# Altium schematic sheet PowerManager.SchDoc
size A4; SheetNumber: 3; SheetTotal: 7
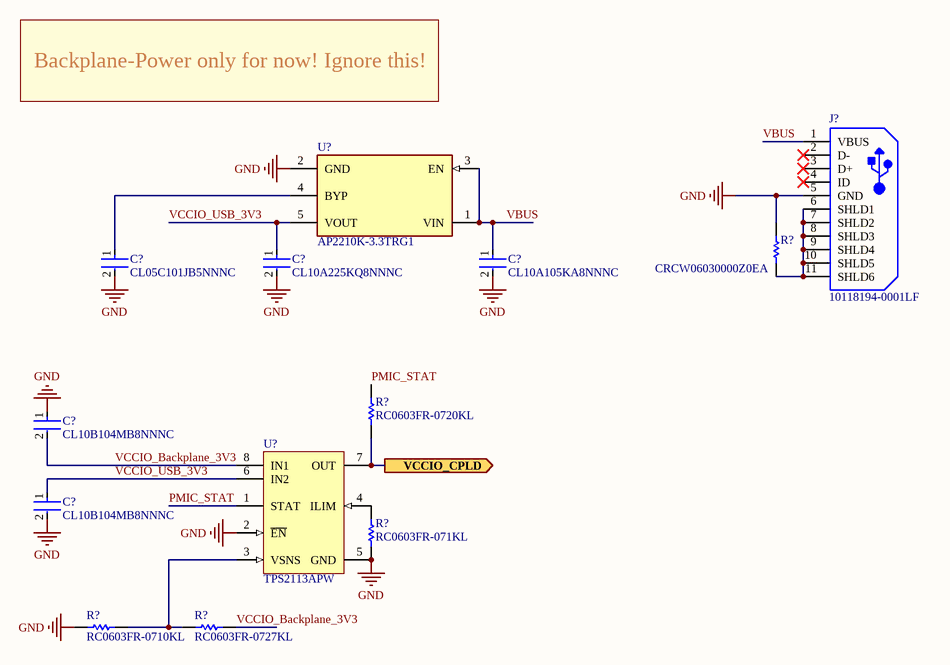
[diagram p0: PowerManager.SchDoc]

## Parts
(Parts that share a designator on the sheet are numbered #1, #2 ... from top to bottom, then left to right.)
C?#1  CL05C101JB5NNNC  [FP-CL05-MFG]
C?#2  CL10A225KQ8NNNC  [FP-CL10-IPC_C]
C?#3  CL10A105KA8NNNC  [FP-CL10-IPC_C]
C?#4  CL10B104MB8NNNC  [FP-CL10-IPC_C]
C?#5  CL10B104MB8NNNC  [FP-CL10-IPC_C]
J?  10118194-0001LF  [FCI-10118194-0001LF-5_V]
R?#1  CRCW06030000Z0EA  [RESC1609X50X30NL8T20]
R?#2  RC0603FR-0720KL  [RESC1608X55X25LL10T15]
R?#3  RC0603FR-071KL  [RESC1608X55X25NL10T15]
R?#4  RC0603FR-0710KL  [RESC1608X55X25ML10T15]
R?#5  RC0603FR-0727KL  [RESC1608X55X25LL10T15]
U?#1  AP2210K-3.3TRG1  [FP-SOT25-MFG]
U?#2  TPS2113APW  [PW0008A_N]

## Ports
VCCIO_CPLD (out)

## Nets
GND: C?#1.2 C?#2.2 C?#3.2 C?#4.1 C?#5.2 J?.5(GND) R?#1.2 R?#3.1 R?#4.1 U?#1.2(GND) U?#2.2(~{EN}) U?#2.5(GND)
PMIC_STAT: R?#2.2 U?#2.1(STAT)
VBUS: C?#3.1 J?.1(VBUS) U?#1.1(VIN) U?#1.3(EN)
VCCIO_Backplane_3V3: C?#4.2 R?#5.2 U?#2.8(IN1)
VCCIO_CPLD: R?#2.1 U?#2.7(OUT) ; port VCCIO_CPLD
VCCIO_USB_3V3: C?#2.1 C?#5.1 U?#1.5(VOUT) U?#2.6(IN2)
NetC?#1_1: C?#1.1 U?#1.4(BYP)
NetJ?_6: J?.6(SHLD1) J?.7(SHLD2) J?.8(SHLD3) J?.9(SHLD4) J?.10(SHLD5) J?.11(SHLD6) R?#1.1
NetR?#3_2: R?#3.2 U?#2.4(ILIM)
NetR?#4_2: R?#4.2 R?#5.1 U?#2.3(VSNS)

Not connected (* = marked no-connect by the designer): J? 2(D-)* 3(D+)* 4(ID)*

## Notes on the sheet
- Backplane-Power only for now! Ignore this!

## Library data of the parts
C?#1 = CMP-13271-000010-1: CAP CER 100PF 50V C0G/NP0 0402; Manufacturer: Samsung; Tolerance: 5%; Temperature Characteristic: C0G; Material: Ceramic; Temperature Coefficient: 30ppm/°C; Capacitance: 100pF; Package: CL05; Device Class L1: Passive Components; Automotive: No; Ipc Land Pattern Name: CAPC10050X50; ComponentLink2URL: http://www.samsungsem.com/global/front/downloadcms.do?path=%2F%2Fglobal%2F%2Fsupport%2F%2Fproduct-search%2F%2Fmlcc%2F%2F__icsFiles%2F%2Fafieldfile%2F%2F2019%2F%2F06%2F%2F18&fileName=CL05C101JB5NNNC-19.pdf; Temperature: -55°C to +125°C; Device Class L2: Capacitors; Digikey Description: CAP CER 100PF 50V C0G/NP0 0402; Value: 100pF; Octopart: https://octopart.com/cl05c101jb5nnnc-samsung-9299367; Manufacturer Part Number: CL05C101JB5NNNC; Temperature Range High: +125°C; Temperature Range Low: -55°C; Lead Free: Yes; ComponentLink2Description: Datasheet; RoHS: TRUE; Device Class L3: Ceramic Capacitors; Height: 0.55mm; Voltage Rating: 50V; Category: Cap
C?#2 = CMP-13271-002410-1: Cap Ceramic 2.2uF 6.3V X5R ±10% Pad SMD 0603 +85°C T/R; Case Code (Imperial): 0603; Voltage: 6.3V; Dielectric: X5R; Capacitance: 2.2uF; Mount: Surface Mount; Packaging: Tape and Reel; Depth: 0.8mm; Voltage Rating (DC): 6.3V; Length: 1.6mm; Case Code (Metric): 1608; Min Operating Temperature: -55°C; Width: 0.031inch; Lead Free: Lead Free; Contact Plating: Tin; Voltage Rating: 6.3V; Thickness: 0.035inch; Tolerance: 10%; Case/Package: 0603; Radiation Hardening: No; Package Quantity: 1; Height: 0.8mm; Max Operating Temperature: 85°C
C?#3 = CMP-13271-004127-1: Cap Ceramic 1uF 25V X5R ±10% Pad SMD 0603 +85°C T/R; Height: 0.8mm; Capacitance: 1uF; Depth: 0.8mm; Package Quantity: 1; Mount: Surface Mount; Contact Plating: Tin; Voltage Rating: 25V; Dielectric: X5R; Packaging: Tape and Reel; Material: Ceramic; Case Code (Metric): 1608; Length: 1.6mm; Voltage: 25V; Min Operating Temperature: -55°C; Width: 0.031inch; Tolerance: 10%; Case/Package: 0603; Radiation Hardening: No; Case Code (Imperial): 0603; Thickness: 0.035inch; Lead Free: Lead Free; Max Operating Temperature: 85°C; Voltage Rating (DC): 25V
C?#4 C?#5 = CMP-13271-001724-1: Cap Ceramic 100nF 50V X7R ±20% Pad SMD 0603 +125°C T/R; Mount: Surface Mount; Lead Free: Lead Free; Max Operating Temperature: 125°C; Voltage Rating: 50V; Case Code (Imperial): 0603; Capacitance: 100nF; Height: 0.8mm; Length: 1.6mm; Tolerance: 20%; Case Code (Metric): 1608; Thickness: 0.035inch; Depth: 0.8mm; Width: 0.031inch; Package Quantity: 1; Min Operating Temperature: -55°C; Case/Package: 0603; Radiation Hardening: No; Voltage Rating (DC): 50V; Dielectric: X7R; Packaging: Tape and Reel
J? = CMP-2000-05120-1: Micro USB B Type Receptacle, 1.8 A, -55 to 85 degC, 5-Pin SMD, RoHS, Tape and Reel; Manufacturer: Amphenol FCI; Body Orientation: RightAngle; Number of Contacts: 5; Pitch: 0.65mm; Gender: RCP; Rad Hard: No; Package Reference: 10118194-0001LF-5; Mounting: SurfaceMount; Manufacturer URL: http://www.fci.com/; Packaging: CutTape; Datasheet URL: https://datasheet.ciiva.com/26945/getdatasheetpartid-418619-26945695.pdf; Termination Method: Solder; Package Description: 5-Pin Surface Mount Device, Body 8.05 x 5.53 mm, Pitch 0.65 mm; Type: MicroUSBTypeB; Datasheet Version: Rev. A, 10/2011
R?#1 = CMP-2000-03816-5: Chip Resistor, 0 Ohm, Jumper, 100 mW, -55 to 155 degC, 0603 (1608 Metric), RoHS, Tape and Reel; Manufacturer: Vishay Semiconductor; Voltage Rating: 75 V; Package Quantity: 5000; DatasheetVersion: 06/2012; Min Operating Temperature: -55 degC; ComponentLink1URL: http://www.vishay.com/; Mounting Technology: Surface Mount; Height: 0.45 mm; ComponentLink1Description: Manufacturer URL; REACH SVHC: Unknown; PackageReference: 0603; Packaging: Tape and Reel; Max Operating Temperature: 155 degC; Mount: Surface Mount; ComponentLink2Description: Datasheet; PackageDescription: 2-Pin Surface Mount Device, Body 1.575 x 0.85 mm; Length: 1.55 mm; ComponentLink2URL: http://www.vishay.com/docs/20035/dcrcwe3.pdf; Pins: 2; RoHSCompliant: true
R?#2 = CMP-2000-06932-1: Chip Resistor, 20 KOhm, +/- 1%, 0.1 W, -55 to 155 degC, 0603 (1608 Metric), RoHS, Tape and Reel; Manufacturer: Yageo; Power Rating: 100mW; Temperature Coefficient: 100PPM/C; Resistance: 20kOhms; Voltage Rating: 50V; Case Code - in: 0603; Packaging: Reel; Datasheet Version: Rev. 7, 05/2017; Series: RC; Mounting Technology: SurfaceMount; Product: ThickFilmResistorsGeneralPurpose; Manufacturer URL: http://www.yageo.com/; Package Description: 2-Pin Surface Mount Device, Body 1.6 x 0.8 mm; Package Reference: 0603; Termination Style: SMD/SMT; Case Code - mm: 1608; Operating Temperature Range: -55Cto+155C; Datasheet URL: http://www.yageo.com/documents/recent/PYu-RC_Group_51_RoHS_L_7.pdf; Tolerance: 1%
R?#3 = CMP-1659-00009-4: Chip Resistor, 1 KOhm, +/-1%, 0.1 W, -55 to 155 degC, 0603 (1608 Metric), RoHS, Tape and Reel; Manufacturer: Yageo; Voltage Rating: 50 V; ComponentLink2URL: http://www.yageo.com/documents/recent/PYu-RC_Group_51_RoHS_L_04.pdf; Max Operating Temperature: 155 degC; PackageDescription: 2-Pin Surface Mount Device, Body 1.6 x 0.8 mm; Packaging: Tape and Reel; ComponentLink3Description: Package Specification; REACH SVHC: No SVHC; Mount: Surface Mount; ComponentLink2Description: Datasheet; Length: 1.6 mm; PackageReference: 0603; Height: 0.45 mm; DatasheetVersion: Rev. 4, 02/2016; Min Operating Temperature: -55 degC; ComponentLink1Description: Manufacturer URL; Package Quantity: 200; RoHSCompliant: true; ComponentLink3URL: http://www.farnell.com/datasheets/443971.pdf; Pins: 2; Mounting Technology: Surface Mount; ComponentLink1URL: http://www.yageo.com/
R?#4 = CMP-2100-03664-1: Chip Resistor, 10 KOhm, +/- 1%, 01 W, -55 to 155 degC, 0603 (1608 Metric), RoHS, Tape and Reel; Manufacturer: Yageo; Temperature Coefficient: 100ppm/degreesC; Resistance: 10KOhm; Voltage Rating: 75V; Power Rating: 100mW; Voltage Rating (DC): 50V; Composition: ThickFilm; RoHSCompliant: true; Height: 0.45mm; Lead Free: LeadFree; Case Code (Metric): 1608; Case/Package: 0603; Datasheet Version: Rev. 5, 10/2016; Package Reference: 0603; Depth: 0.8mm; Package Description: 2-Pin Surface Mount Device, Body 1.6 x 0.8 mm; Case Code (Imperial): 0603; Packaging: TapeandReel; Termination: SMD/SMT; Lead Pitch: 0.3mm; Width: 0.8mm; Number of Pins: 2; Length: 1.6mm; REACH SVHC: NoSVHC; Military Standard: Not; Max Operating Temperature: 155degC; Min Operating Temperature: -55degC; Manufacturer URL: http://www.yageo.com/; Datasheet URL: http://www.yageo.com/NewPortal/yageodocoutput?fileName=/pdf/R-Chip/PYu-RC_Group_51_RoHS_L_5.pdf; Weight: 7.1E-05oz; Tolerance: 1%
R?#5 = CMP-2000-06933-1: Chip Resistor, 27 KOhm, +/- 1%, 0.1 W, -55 to 155 degC, 0603 (1608 Metric), RoHS, Tape and Reel; Manufacturer: Yageo; Resistance: 27kOhms; Temperature Coefficient: 100PPM/C; Power Rating: 100mW; Voltage Rating: 50V; Mounting Technology: SurfaceMount; Operating Temperature Range: -55Cto+155C; Case Code - in: 0603; Product: ThickFilmResistorsGeneralPurpose; Package Reference: 0603; Datasheet Version: Rev. 7, 05/2017; Tolerance: 1%; Manufacturer URL: http://www.yageo.com/; Termination Style: SMD/SMT; Packaging: Reel; Series: RC; Package Description: 2-Pin Surface Mount Device, Body 1.6 x 0.8 mm; Datasheet URL: http://www.yageo.com/documents/recent/PYu-RC_Group_51_RoHS_L_7.pdf; Case Code - mm: 1608
U?#1 = CMP-12756-000023-1: IC REG LINEAR 3.3V 300MA SOT23-5; Manufacturer: Diodes; Number Of Outputs: 1; Max Supply Voltage: 13.2V; Max Junction Temp: +125°C; Accuracy Percentage: 1%; Nominal Supply Current: 0.01uA; Output Type: Fixed; Min Supply Voltage: 2.5V; Dropout Voltage: 250mV; Standoff Height: 0.013mm; Temperature: -40°C to +85°C; Temperature Range High: +85°C; Device Class L3: Voltage Regulators - Linear; Package: SOT25; ComponentLink2Description: Datasheet; ComponentLink2URL: https://www.diodes.com/assets/Datasheets/AP2210.pdf; Digikey Description: IC REG LINEAR 3.3V 300MA SOT23-5; Height: 1.4mm; Lead Free: Yes; Footprint Url: https://www.diodes.com/assets/Package-Files/SOT25.pdf; Mouser Description: LDO Voltage Regulators 300mA CMOS LDO 3.3V 250mV; Output Current: 300mA; Output Voltage: 3.3V; Category: IC; Octopart: https://octopart.com/ap2210k-3.3trg1-diodes+inc.-30954630; RoHS: TRUE; Device Class L1: Integrated Circuits (ICs); Temperature Range Low: -40°C; Device Class L2: Power Management ICs; Automotive: No; Manufacturer Part Number: AP2210K-3.3TRG1
U?#2 = CMP-0339-00043-2: Dual In / Single Out Autoswitching Power Mux, 2.8 to 5.5 V, -40 to 85 degC, 8-pin TSSOP (PW), Green (RoHS & no Sb/Br); Manufacturer: Texas Instruments; IN2 Output Current(Max)(A): 1.25; SubFamily: Power Multiplexer (MUX); IN2 rDS(on)(Typ)(Ohms): 0.084; IN1, IN2 Input Voltage(Min)(V): 2.8; IN1 rDS(on)(Typ)(mOhm): 84; IN1, IN2 Input Voltage(Max)(V): 5.5; Number of Inputs: 2; Mounting Technology: Surface Mount; Code_JEDEC: MO-153; IN1 Output Current(Max)(A): 1.25; DatasheetVersion: SBVS045C; ComponentLink1Description: Datasheet; PackageVersion: revG, Feb-2011; Eco-Plan: Green (RoHS & no Sb/Br); ComponentLink1URL: http://www.ti.com/general/docs/lit/getliterature.tsp?genericPartNumber=TPS2113A&fileType=pdf; PackageDescription: 8-Pin Plastic Thin Small Outline Package 3 x 4.4 mm Body ,0.65 mm Pitch; PackageReference: PW0008A; PartNumber: TPS2113APW